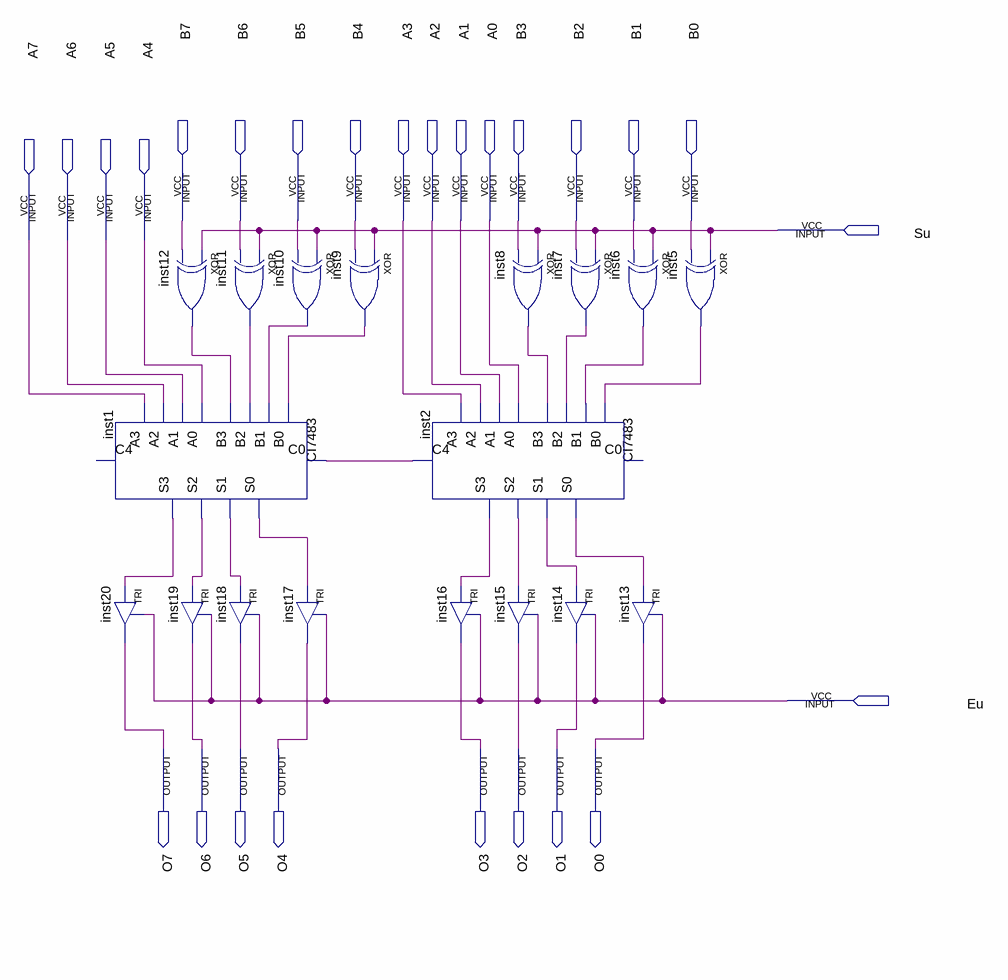
[diagram p0: schematic sheet]
// Quartus schematic SomadorSubtrator.bdf as structural Verilog: 18 symbols, 26 pins
module SomadorSubtrator (
  input  B7,
  input  B6,
  input  B5,
  input  B4,
  input  A3,
  input  A2,
  input  A1,
  input  A0,
  input  B3,
  input  B2,
  input  B1,
  input  B0,
  input  Su,
  input  A7,
  input  A6,
  input  A5,
  input  A4,
  input  Eu,
  output O7,
  output O6,
  output O5,
  output O4,
  output O3,
  output O2,
  output O1,
  output O0
);

  wire inst1_s0, inst1_s1, inst1_s2, inst1_s3, inst2_c4, inst2_s0, inst2_s1, inst2_s2, inst2_s3, inst5_out,
       inst6_out, inst7_out, inst8_out, inst9_out, inst10_out, inst11_out, inst12_out;

  xor inst12 (inst12_out, Su, B7);
  CI7483 inst1 (
    .C0(inst2_c4), .A0(A4), .B0(inst9_out), .A1(A5), .B1(inst10_out), .A2(A6), .B2(inst11_out), .A3(A7),
    .B3(inst12_out), .S1(inst1_s1), .S2(inst1_s2), .S3(inst1_s3), .S0(inst1_s0));  // open: C4
  TRI inst20 (.IN(inst1_s3), .OE(Eu), .OUT(O7));
  xor inst11 (inst11_out, Su, B6);
  TRI inst18 (.IN(inst1_s1), .OE(Eu), .OUT(O5));
  TRI inst19 (.IN(inst1_s2), .OE(Eu), .OUT(O6));
  xor inst10 (inst10_out, Su, B5);
  TRI inst17 (.IN(inst1_s0), .OE(Eu), .OUT(O4));
  xor inst9 (inst9_out, Su, B4);
  CI7483 inst2 (
    .A0(A0), .B0(inst5_out), .A1(A1), .B1(inst6_out), .A2(A2), .B2(inst7_out), .A3(A3), .B3(inst8_out),
    .S1(inst2_s1), .S2(inst2_s2), .S3(inst2_s3), .S0(inst2_s0), .C4(inst2_c4));  // open: C0
  TRI inst16 (.IN(inst2_s3), .OE(Eu), .OUT(O3));
  xor inst8 (inst8_out, Su, B3);
  TRI inst15 (.IN(inst2_s2), .OE(Eu), .OUT(O2));
  xor inst6 (inst6_out, Su, B1);
  xor inst7 (inst7_out, Su, B2);
  TRI inst13 (.IN(inst2_s0), .OE(Eu), .OUT(O0));
  TRI inst14 (.IN(inst2_s1), .OE(Eu), .OUT(O1));
  xor inst5 (inst5_out, Su, B0);
endmodule
